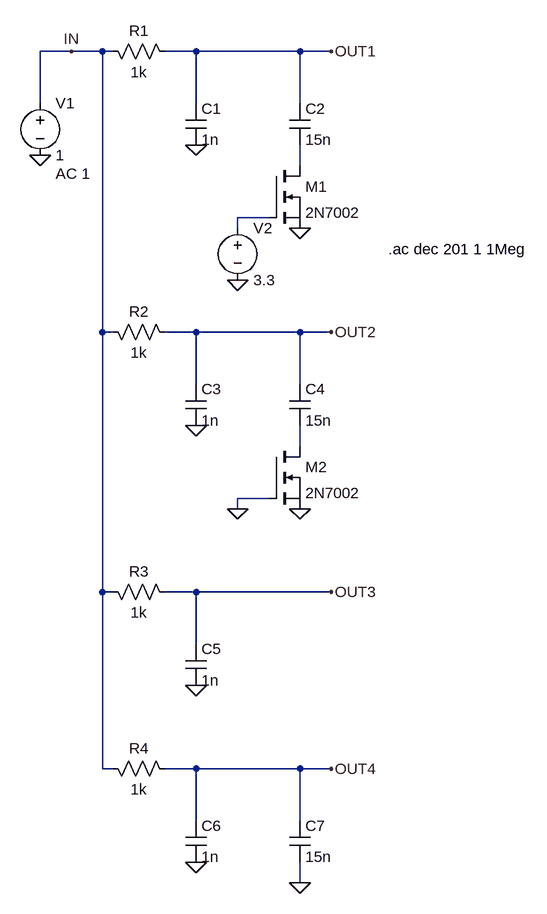
[diagram p0: schematic LP_Filters_Work_With_NFET_Switched_Capacitor.asc]
LP_Filters_Work_With_NFET_Switched_Capacitor.asc, the LTspice schematic file:
Version 4
SHEET 1 880 1428
WIRE 48 32 0 32
WIRE 96 32 48 32
WIRE 112 32 96 32
WIRE 240 32 192 32
WIRE 400 32 240 32
WIRE 448 32 400 32
WIRE 0 112 0 32
WIRE 240 112 240 32
WIRE 400 112 400 32
WIRE 400 208 400 176
WIRE 352 288 304 288
WIRE 304 304 304 288
WIRE 96 464 96 32
WIRE 112 464 96 464
WIRE 240 464 192 464
WIRE 400 464 240 464
WIRE 448 464 400 464
WIRE 240 544 240 464
WIRE 400 544 400 464
WIRE 400 640 400 608
WIRE 352 720 304 720
WIRE 304 736 304 720
WIRE 96 864 96 464
WIRE 112 864 96 864
WIRE 240 864 192 864
WIRE 448 864 240 864
WIRE 240 944 240 864
WIRE 96 1136 96 864
WIRE 112 1136 96 1136
WIRE 240 1136 192 1136
WIRE 400 1136 240 1136
WIRE 448 1136 400 1136
WIRE 240 1216 240 1136
WIRE 400 1216 400 1136
WIRE 400 1312 400 1280
FLAG 0 192 0
FLAG 240 176 0
FLAG 448 32 OUT1
FLAG 48 32 IN
FLAG 400 304 0
FLAG 304 384 0
FLAG 240 608 0
FLAG 448 464 OUT2
FLAG 400 736 0
FLAG 304 736 0
FLAG 240 1008 0
FLAG 448 864 OUT3
FLAG 240 1280 0
FLAG 448 1136 OUT4
FLAG 400 1312 0
SYMBOL voltage 0 96 R0
WINDOW 123 24 124 Left 2
WINDOW 39 0 0 Left 0
SYMATTR InstName V1
SYMATTR Value 1
SYMATTR Value2 AC 1
SYMBOL res 208 48 M270
WINDOW 0 32 56 VTop 2
WINDOW 3 0 56 VBottom 2
SYMATTR InstName R1
SYMATTR Value 1k
SYMBOL cap 224 112 R0
SYMATTR InstName C1
SYMATTR Value 1n
SYMBOL cap 384 112 R0
SYMATTR InstName C2
SYMATTR Value 15n
SYMBOL nmos 352 208 R0
SYMATTR InstName M1
SYMATTR Value 2N7002
SYMBOL voltage 304 288 R0
SYMATTR InstName V2
SYMATTR Value 3.3
SYMBOL res 208 480 M270
WINDOW 0 32 56 VTop 2
WINDOW 3 0 56 VBottom 2
SYMATTR InstName R2
SYMATTR Value 1k
SYMBOL cap 224 544 R0
SYMATTR InstName C3
SYMATTR Value 1n
SYMBOL cap 384 544 R0
SYMATTR InstName C4
SYMATTR Value 15n
SYMBOL nmos 352 640 R0
SYMATTR InstName M2
SYMATTR Value 2N7002
SYMBOL res 208 880 M270
WINDOW 0 32 56 VTop 2
WINDOW 3 0 56 VBottom 2
SYMATTR InstName R3
SYMATTR Value 1k
SYMBOL cap 224 944 R0
SYMATTR InstName C5
SYMATTR Value 1n
SYMBOL res 208 1152 M270
WINDOW 0 32 56 VTop 2
WINDOW 3 0 56 VBottom 2
SYMATTR InstName R4
SYMATTR Value 1k
SYMBOL cap 224 1216 R0
SYMATTR InstName C6
SYMATTR Value 1n
SYMBOL cap 384 1216 R0
SYMATTR InstName C7
SYMATTR Value 15n
TEXT 536 336 Left 2 !.ac dec 201 1 1Meg

The netlist it stands for:
* LP_Filters_Work_With_NFET_Switched_Capacitor.asc
V1 IN 0 1 AC 1
R1 OUT1 IN 1k
C1 OUT1 0 1n
C2 OUT1 N001 15n
M1 N001 N002 0 0 2N7002
V2 N002 0 3.3
R2 OUT2 IN 1k
C3 OUT2 0 1n
C4 OUT2 N003 15n
M2 N003 0 0 0 2N7002
R3 OUT3 IN 1k
C5 OUT3 0 1n
R4 OUT4 IN 1k
C6 OUT4 0 1n
C7 OUT4 0 15n
.model NMOS NMOS
.model PMOS PMOS
.lib standard.mos
.ac dec 201 1 1Meg
.backanno
.end